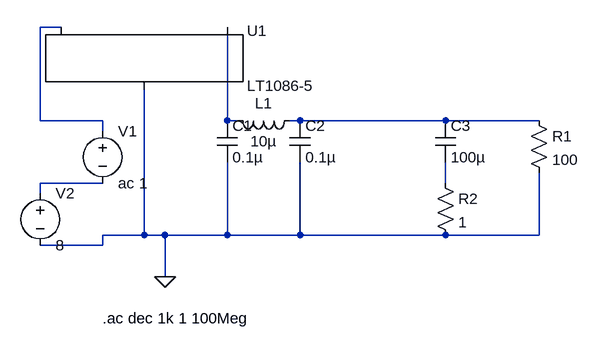
[diagram p0: schematic power_pi.asc]
power_pi.asc, the LTspice schematic file:
Version 4
SHEET 1 880 680
WIRE 48 80 16 80
WIRE 16 224 16 80
WIRE 112 224 16 224
WIRE 304 224 304 80
WIRE 320 224 304 224
WIRE 416 224 400 224
WIRE 640 224 416 224
WIRE 784 224 640 224
WIRE 112 240 112 224
WIRE 112 320 16 320
WIRE 640 320 640 288
WIRE 16 336 16 320
WIRE 176 400 176 176
WIRE 176 400 112 400
WIRE 208 400 176 400
WIRE 304 400 304 288
WIRE 304 400 208 400
WIRE 416 400 416 288
WIRE 416 400 304 400
WIRE 640 400 416 400
WIRE 784 400 784 304
WIRE 784 400 640 400
WIRE 112 416 112 400
WIRE 112 416 16 416
WIRE 208 464 208 400
FLAG 208 464 0
SYMBOL cap 288 224 R0
SYMATTR InstName C1
SYMATTR Value 0.1µ
SYMBOL cap 400 224 R0
SYMATTR InstName C2
SYMATTR Value 0.1µ
SYMBOL cap 624 224 R0
SYMATTR InstName C3
SYMATTR Value 100µ
SYMBOL ind 416 208 R90
WINDOW 0 5 56 VBottom 2
WINDOW 3 32 56 VTop 2
SYMATTR InstName L1
SYMATTR Value 10µ
SYMBOL res 768 208 R0
SYMATTR InstName R1
SYMATTR Value 100
SYMBOL res 624 304 R0
SYMATTR InstName R2
SYMATTR Value 1
SYMBOL voltage 112 224 R0
SYMATTR InstName V1
SYMATTR Value ac 1
SYMBOL PowerProducts/LT1086-5 176 80 R0
SYMATTR InstName U1
SYMBOL voltage 16 320 R0
SYMATTR InstName V2
SYMATTR Value 8
TEXT 112 528 Left 2 !.ac dec 1k 1 100Meg

The netlist it stands for:
* power_pi.asc
C1 N002 0 0.1µ
C2 N003 0 0.1µ
C3 N003 N005 100µ
L1 N003 N002 10µ
R1 N003 0 100
R2 N005 0 1
V1 N001 N004 ac 1
XU1 0 N002 N001 LT1086-5
V2 N004 0 8
.ac dec 1k 1 100Meg
.backanno
.end